# Altium schematic sheet MCU-144pins.SchDoc
size A3
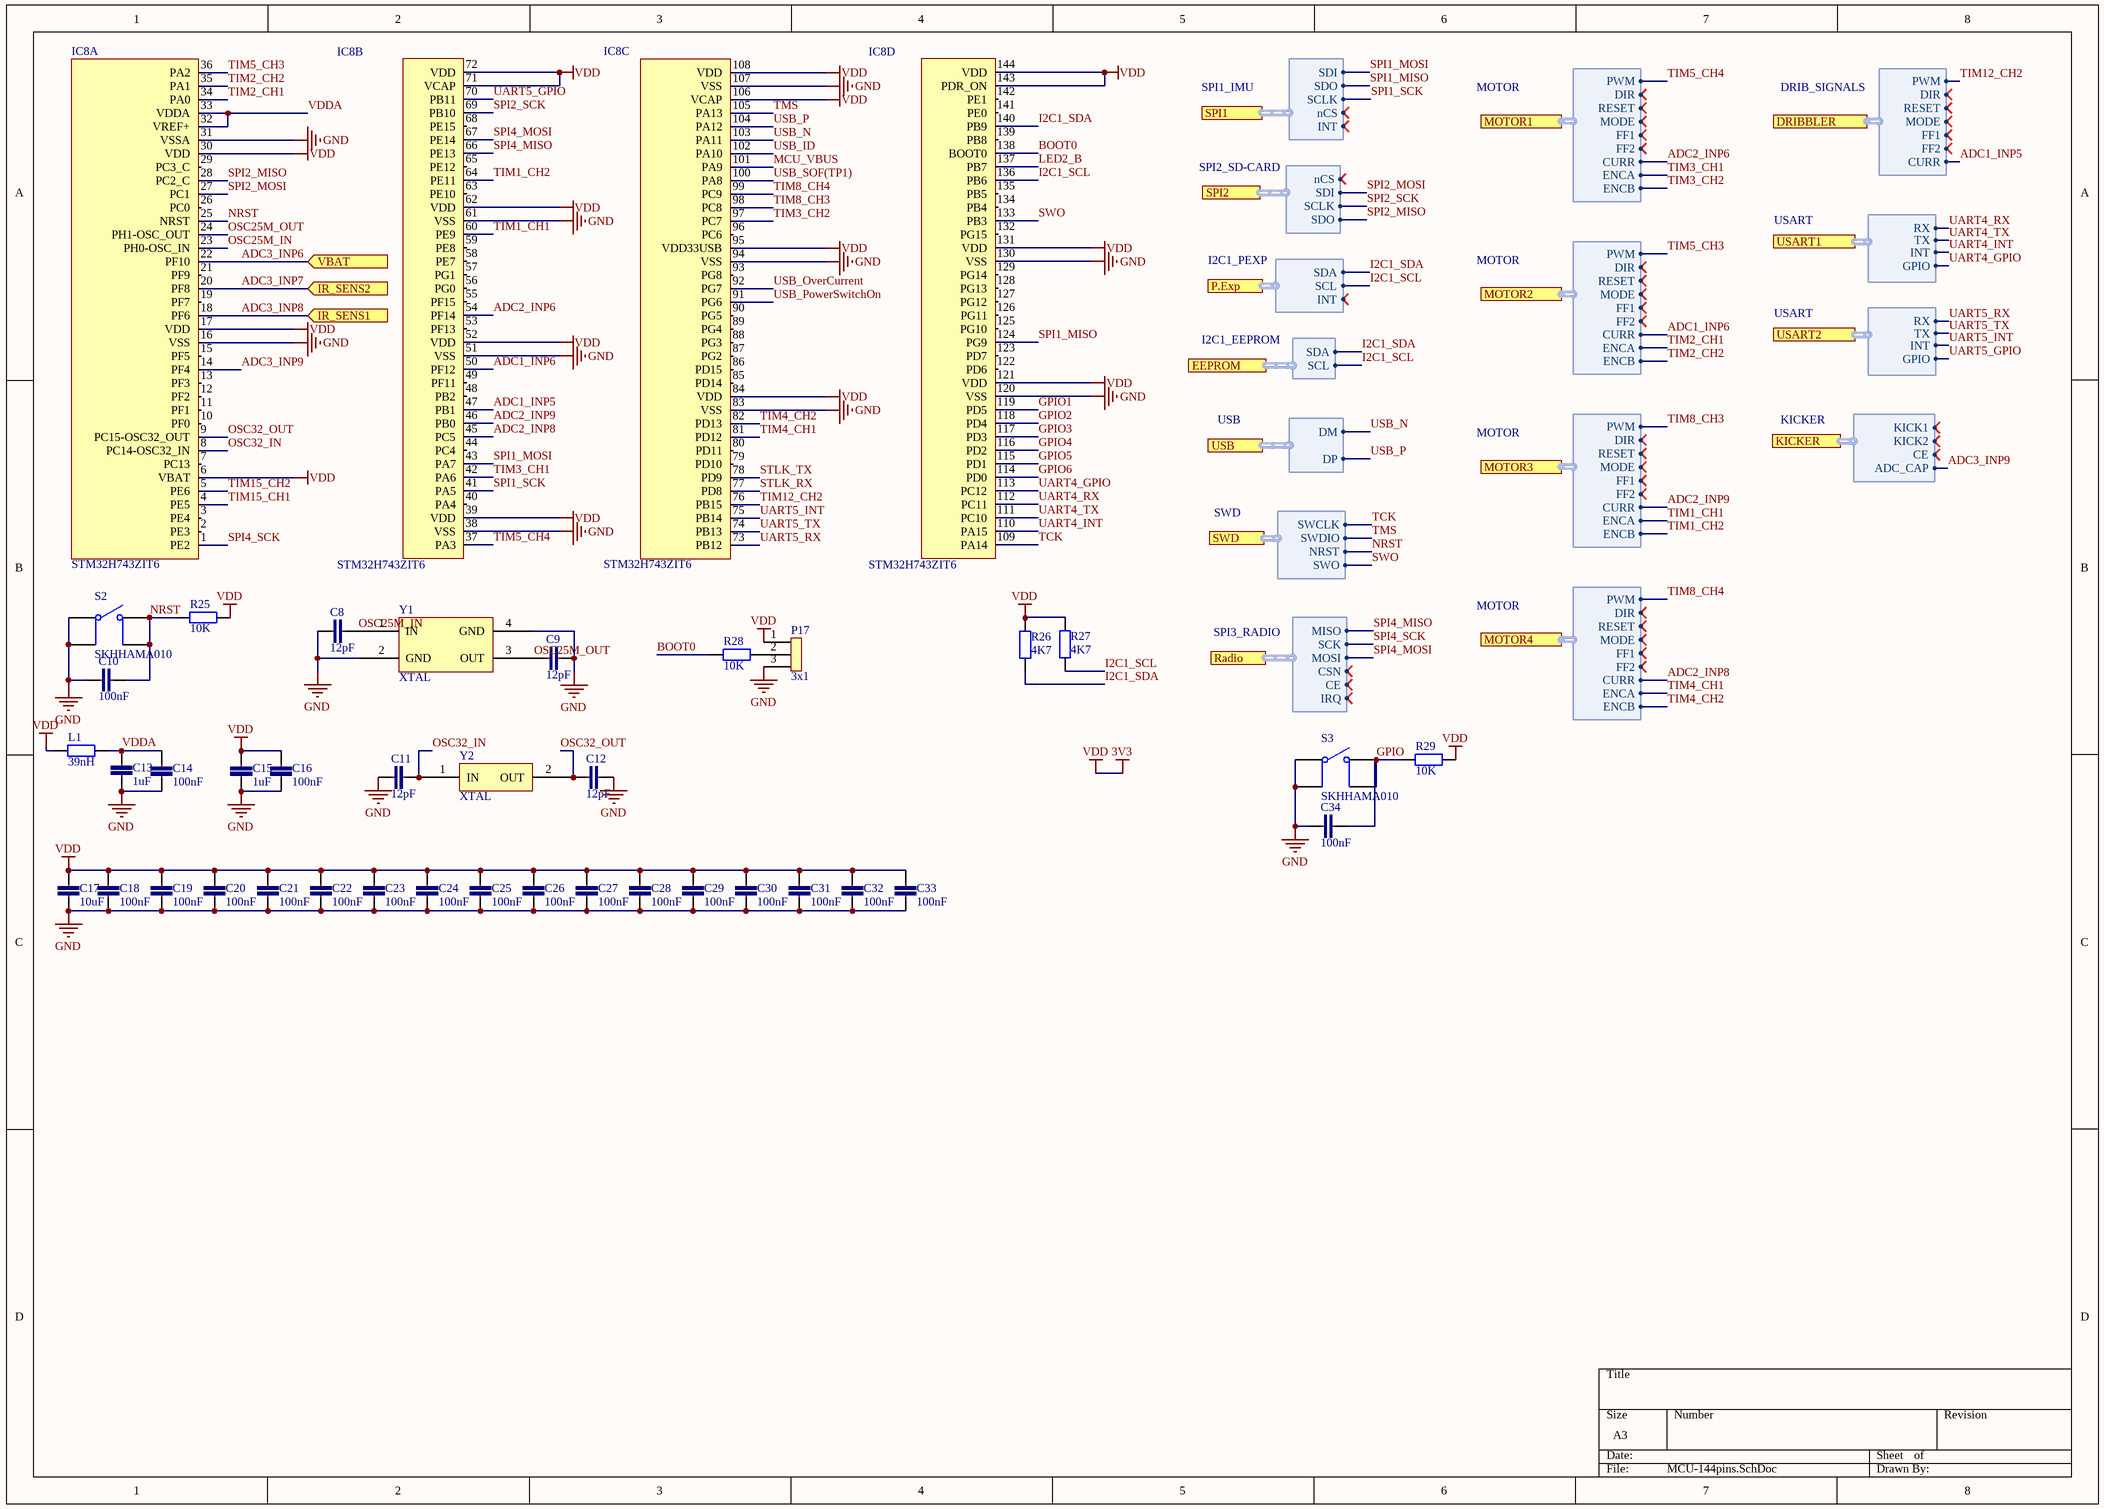
[diagram p0: MCU-144pins.SchDoc]

## Parts
C8  12pF  [CAP CER 0603]
C9  12pF  [CAP CER 0603]
C10  100nF  [CAP CER 0603]
C11  12pF  [CAP CER 0603]
C12  12pF  [CAP CER 0603]
C13  1uF  [CAP CER 0603]
C14  100nF  [CAP CER 0603]
C15  1uF  [CAP CER 0603]
C16  100nF  [CAP CER 0603]
C17  10uF  [CAP CER 0603]
C18  100nF  [CAP CER 0603]
C19  100nF  [CAP CER 0603]
C20  100nF  [CAP CER 0603]
C21  100nF  [CAP CER 0603]
C22  100nF  [CAP CER 0603]
C23  100nF  [CAP CER 0603]
C24  100nF  [CAP CER 0603]
C25  100nF  [CAP CER 0603]
C26  100nF  [CAP CER 0603]
C27  100nF  [CAP CER 0603]
C28  100nF  [CAP CER 0603]
C29  100nF  [CAP CER 0603]
C30  100nF  [CAP CER 0603]
C31  100nF  [CAP CER 0603]
C32  100nF  [CAP CER 0603]
C33  100nF  [CAP CER 0603]
C34  100nF  [CAP CER 0603]
IC8  STM32H743ZIT6  [LQFP-144]  (parts A,B,C,D of 4)
L1  39nH  [IND SMD 0603]
P17  3x1  [HEADER 3X1 MALE]
R25  10K  [RES SMD 0603]
R26  4K7  [RES SMD 0603]
R27  4K7  [RES SMD 0603]
R28  10K  [RES SMD 0603]
R29  10K  [RES SMD 0603]
S2  SKHHAMA010  [TACT-SWITCH-6X6X5]
S3  SKHHAMA010  [TACT-SWITCH-6X6X5]
Y1  XTAL  [XTAL-200X160]
Y2  XTAL  [XTAL-200X120]

## Ports
DRIBBLER (harness DRIB_SIGNALS), EEPROM (harness I2C1_EEPROM), IR_SENS1 (in), IR_SENS2 (in), KICKER (harness KICKER), MOTOR1 (harness MOTOR), MOTOR2 (harness MOTOR), MOTOR3 (harness MOTOR), MOTOR4 (harness MOTOR), P.Exp (harness I2C1_PEXP), Radio (harness SPI3_RADIO), SPI1 (harness SPI1_IMU), SPI2 (harness SPI2_SD-CARD), SWD (harness SWD), USART1 (harness USART), USART2 (harness USART), USB (harness USB), VBAT (in)

## Harnesses
SPI1_IMU: SDI, SDO, SCLK, nCS, INT
I2C1_PEXP: SDA, SCL, INT
SPI2_SD-CARD: nCS, SDI, SCLK, SDO
I2C1_EEPROM: SDA, SCL
SWD: SWCLK, SWDIO, NRST, SWO
USB: DM, DP
SPI3_RADIO: MISO, SCK, MOSI, CSN, CE, IRQ
MOTOR: PWM, DIR, RESET, MODE, FF1, FF2, CURR, ENCA, ENCB
DRIB_SIGNALS: PWM, DIR, RESET, MODE, FF1, FF2, CURR
USART: RX, TX, INT, GPIO
KICKER: KICK1, KICK2, CE, ADC_CAP

## Nets
3V3: C15.1 C16.1 C17.1 C18.1 C19.1 C20.1 C21.1 C22.1 C23.1 C24.1 C25.1 C26.1 C27.1 C28.1 C29.1 C30.1 C31.1 C32.1 C33.1 IC8.6(VBAT) IC8.17(VDD) IC8.30(VDD) IC8.39(VDD) IC8.52(VDD) IC8.62(VDD) IC8.71(VCAP) IC8.72(VDD) IC8.84(VDD) IC8.95(VDD33USB) IC8.106(VCAP) IC8.108(VDD) IC8.121(VDD) IC8.131(VDD) IC8.143(PDR_ON) IC8.144(VDD) L1.2 P17.1 R25.1 R26.2 R27.2 R29.1  [also labelled VDD]
GND: C8.1 C9.2 C10.1 C11.1 C12.2 C13.2 C14.2 C15.2 C16.2 C17.2 C18.2 C19.2 C20.2 C21.2 C22.2 C23.2 C24.2 C25.2 C26.2 C27.2 C28.2 C29.2 C30.2 C31.2 C32.2 C33.2 C34.1 IC8.16(VSS) IC8.31(VSSA) IC8.38(VSS) IC8.51(VSS) IC8.61(VSS) IC8.83(VSS) IC8.94(VSS) IC8.107(VSS) IC8.120(VSS) IC8.130(VSS) P17.3 S2.1 S2.2 S3.1 S3.2 Y1.2(GND) Y1.4(GND)
ADC1_INP5: IC8.47(PB1) ; port DRIBBLER.CURR
ADC1_INP6: IC8.50(PF12) ; port MOTOR2.CURR
ADC2_INP6: IC8.54(PF14) ; port MOTOR1.CURR
ADC2_INP8: IC8.45(PC5) ; port MOTOR4.CURR
ADC2_INP9: IC8.46(PB0) ; port MOTOR3.CURR
ADC3_INP6: IC8.22(PF10) ; port VBAT
ADC3_INP7: IC8.20(PF8) ; port IR_SENS2
ADC3_INP8: IC8.18(PF6) ; port IR_SENS1
ADC3_INP9: IC8.14(PF4) ; port KICKER.ADC_CAP
BOOT0: IC8.138(BOOT0) R28.2
GPIO: C34.2 R29.2 S3.3 S3.4
GPIO1: IC8.119(PD5)
GPIO2: IC8.118(PD4)
GPIO3: IC8.117(PD3)
GPIO4: IC8.116(PD2)
GPIO5: IC8.115(PD1)
GPIO6: IC8.114(PD0)
I2C1_SCL: IC8.136(PB6) R27.1 ; port P.Exp.SCL, port EEPROM.SCL
I2C1_SDA: IC8.140(PB9) R26.1 ; port P.Exp.SDA, port EEPROM.SDA
LED2_B: IC8.137(PB7)
MCU_VBUS: IC8.101(PA9)
NRST: C10.2 IC8.25(NRST) R25.2 S2.3 S2.4 ; port SWD.NRST
OSC25M_IN: C8.2 IC8.23(PH0-OSC_IN) Y1.1(IN)
OSC25M_OUT: C9.1 IC8.24(PH1-OSC_OUT) Y1.3(OUT)
OSC32_IN: C11.2 IC8.8(PC14-OSC32_IN) Y2.1(IN)
OSC32_OUT: C12.1 IC8.9(PC15-OSC32_OUT) Y2.2(OUT)
SPI1_MISO: IC8.124(PG9) ; port SPI1.SDO
SPI1_MOSI: IC8.43(PA7) ; port SPI1.SDI
SPI1_SCK: IC8.41(PA5) ; port SPI1.SCLK
SPI2_MISO: IC8.28(PC2_C) ; port SPI2.SDO
SPI2_MOSI: IC8.27(PC1) ; port SPI2.SDI
SPI2_SCK: IC8.69(PB10) ; port SPI2.SCLK
SPI4_MISO: IC8.66(PE13) ; port Radio.MISO
SPI4_MOSI: IC8.67(PE14) ; port Radio.MOSI
SPI4_SCK: IC8.1(PE2) ; port Radio.SCK
STLK_RX: IC8.77(PD8)
STLK_TX: IC8.78(PD9)
SWO: IC8.133(PB3) ; port SWD.SWO
TCK: IC8.109(PA14) ; port SWD.SWCLK
TIM1_CH1: IC8.60(PE9) ; port MOTOR3.ENCA
TIM1_CH2: IC8.64(PE11) ; port MOTOR3.ENCB
TIM2_CH1: IC8.34(PA0) ; port MOTOR2.ENCA
TIM2_CH2: IC8.35(PA1) ; port MOTOR2.ENCB
TIM3_CH1: IC8.42(PA6) ; port MOTOR1.ENCA
TIM3_CH2: IC8.97(PC7) ; port MOTOR1.ENCB
TIM4_CH1: IC8.81(PD12) ; port MOTOR4.ENCA
TIM4_CH2: IC8.82(PD13) ; port MOTOR4.ENCB
TIM5_CH3: IC8.36(PA2) ; port MOTOR2.PWM
TIM5_CH4: IC8.37(PA3) ; port MOTOR1.PWM
TIM8_CH3: IC8.98(PC8) ; port MOTOR3.PWM
TIM8_CH4: IC8.99(PC9) ; port MOTOR4.PWM
TIM12_CH2: IC8.76(PB15) ; port DRIBBLER.PWM
TIM15_CH1: IC8.4(PE5)
TIM15_CH2: IC8.5(PE6)
TMS: IC8.105(PA13) ; port SWD.SWDIO
UART4_GPIO: IC8.113(PC12) ; port USART1.GPIO
UART4_INT: IC8.110(PA15) ; port USART1.INT
UART4_RX: IC8.112(PC11) ; port USART1.RX
UART4_TX: IC8.111(PC10) ; port USART1.TX
UART5_GPIO: IC8.70(PB11) ; port USART2.GPIO
UART5_INT: IC8.75(PB14) ; port USART2.INT
UART5_RX: IC8.73(PB12) ; port USART2.RX
UART5_TX: IC8.74(PB13) ; port USART2.TX
USB_ID: IC8.102(PA10)
USB_N: IC8.103(PA11) ; port USB.DM
USB_OverCurrent: IC8.92(PG7)
USB_P: IC8.104(PA12) ; port USB.DP
USB_PowerSwitchOn: IC8.91(PG6)
USB_SOF(TP1): IC8.100(PA8)
VDDA: C13.1 C14.1 IC8.32(VREF+) IC8.33(VDDA) L1.1
NetP17_2: P17.2 R28.1

Not connected (* = marked no-connect by the designer): IC8 2(PE3) 3(PE4) 7(PC13) 10(PF0) 11(PF1) 12(PF2) 13(PF3) 15(PF5) 19(PF7) 21(PF9) 26(PC0) 29(PC3_C) 40(PA4) 44(PC4) 48(PB2) 49(PF11) 53(PF13) 55(PF15) 56(PG0) 57(PG1) 58(PE7) 59(PE8) 63(PE10) 65(PE12) 68(PE15) 79(PD10) 80(PD11) 85(PD14) 86(PD15) 87(PG2) 88(PG3) 89(PG4) 90(PG5) 93(PG8) 96(PC6) 122(PD6) 123(PD7) 125(PG10) 126(PG11) 127(PG12) 128(PG13) 129(PG14) 132(PG15) 134(PB4) 135(PB5) 139(PB8) 141(PE0) 142(PE1)

## Library data of the parts
C8 C9 C11 C12 = CAP CER 0603 50V 12pF: Multilayer Ceramic Capacitors MLCC - SMD/SMT 50V 12pF 0603 C0G 5%; Mfr Nr: C0603C120J5GAC; Mfr: KEMET; Type: Ceramic Capacitor; Dimensions: 0603 (1608 metric); Series: SMD Comm C0G; Voltage Rating: 50V; Value: 12pF
C10 C14 C16 C18-C34 = CAP CER 0603 25V 100nF: Multilayer Ceramic Capacitors MLCC - SMD/SMT 25V 0.1uF 0603 Y5V -20/+80%; Mfr Nr: C0603C104Z3VACTU; Mfr: KEMET; Type: Ceramic Capacitor; Dimensions: 0603 (1608 metric); Voltage Rating: 25V; Series: SMD Comm Y5V; Value: 100nF
C13 C15 = CAP CER 0603 25V 1uF: Multilayer Ceramic Capacitors MLCC - SMD/SMT 1uF 25V X5R 10%; Mfr Nr: C0603C105K3PAC7411; Mfr: KEMET; Type: Ceramic Capacitor; Dimensions: 0603 (1608 metric); Voltage Rating: 25V; Series: SMD Comm X5R; Value: 1uF
C17 = CAP CER 0603 6.3V 10uF: Multilayer Ceramic Capacitors MLCC - SMD/SMT 0603 6.3V 10uF X5R 10% Soft Term; Mfr Nr: C1608X5R0J106K080AE; Mfr: TDK; Type: Ceramic Capacitor; Dimensions: 0603 (1608 metric); Voltage Rating: 6.3V; Series: C; Value: 10uF
IC8 = STM32H743ZIT6: ARM Microcontrollers - MCU High-performance and DSP with DP-FPU, ARM Cortex-M7 MCU with 2MBytes Flash, 1MB RAM, 400 MHz CPU, Art Accelerator, L1 cache, external memory interface, large set of peripherals; Mfr: STMicroelectronics; Core: ARM Cortex M7; Mfr Nr: STM32H743ZIT6; Package: LQFP-144; Series: STM32H743ZI
L1 = IND SMD 0603 300mA: FIXED IND 39NH 300MA 600 MOHM; ComponentLink1Description: New link; ComponentLink1URL: https://www.mouser.ie/ProductDetail/Wurth-Elektronik/7447860139?qs=sPbYRqrBIVnOGz9%2FqJxoDA%3D%3D
P17 = HEADER 3P M: Headers & Wire Housings 03 SIL VERTICAL PIN HEADER TIN; Mfr Nr: M20-9770346
R25 R28 R29 = RES SMD 0603 10K: Thick Film Resistors - SMD 1/10Watt 10Kohms 1% Commercial Use; Mfr: Vishay / Dale; Mfr Nr: CRCW060310K0FKEAC; Power Rating: 1/10 W; Dimensions: 0603 (1608 metric); Value: 10K
R26 R27 = RES SMD 0603 4K7
S2 S3 = SKHHAMA010: Tactile Switches 6.0x6.0x5.0mm 160gf; Mfr: ALPS; Contact Form: SPST; Voltage Rating: 12 VDC; Current Rating: 50 mA; Mfr Nr: SKHHAMA010; Series: SKHH; Type: Tactile Switch
Y1 = FA-12825F10Z-AC: Crystals 25MHz 10PPM -20C +75C 9.0pF; Mfr Nr: FA-128  25.0000MF10Z-AC; Mfr: Epson Timing; Load Capacitance: 9 pF; ESR: 80 Ohms; Package: 2 mm x 1.6 mm; Frequency: 25 MHz; Series: FA-128; Tolerance: 10 PPM
Y2 = ABS06-32.768KHZ-9-T: Crystals 32.768KHz 9pF 20ppm -40 C+85C; Mfr: ABRACON; ESR: 90 kOhms; Mfr Nr: ABS06-32.768KHZ-9-T; Package: 2 mm x 1.6 mm; Load Capacitance: 9 pF; Frequency: 32.768 kHz; Series: ABS06; Tolerance: 20 PPM